# Altium project RPi_sensor_expansion_board.PrjPCB
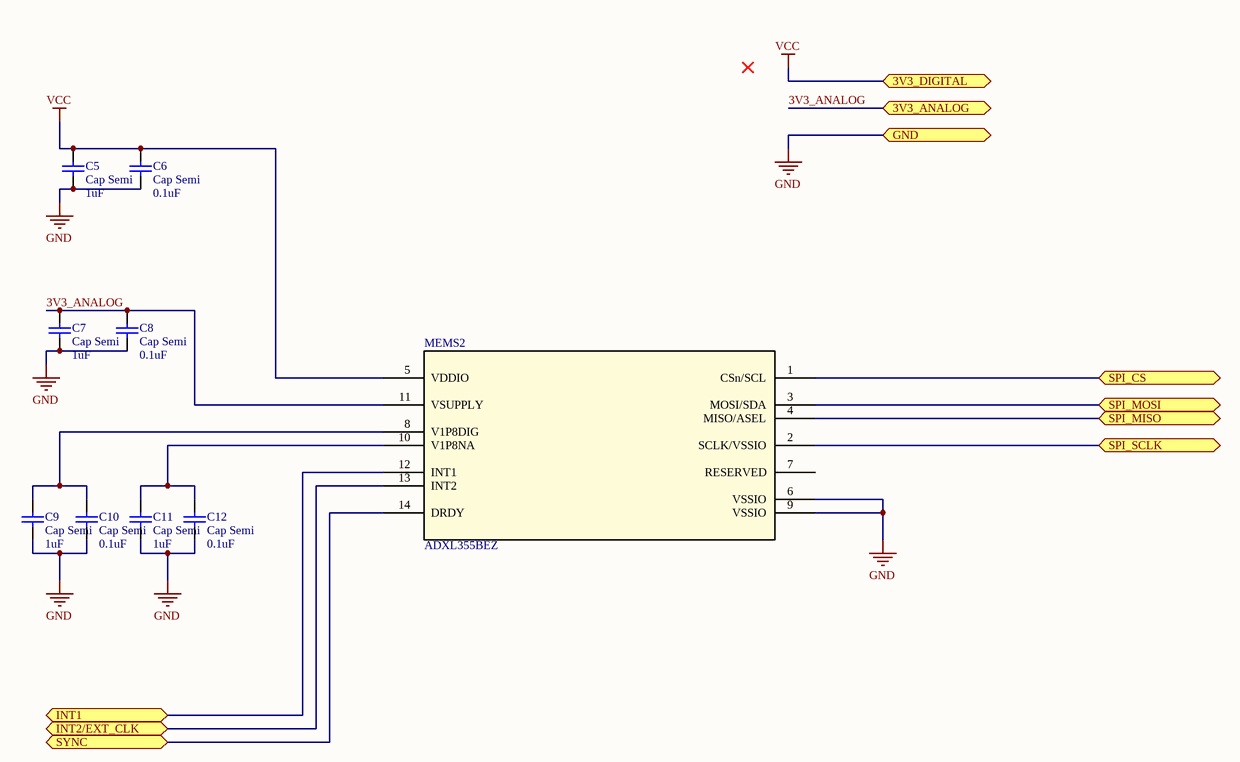
[diagram p0: accelerometer.SchDoc]
6 sheets, 58 parts. Net scope: flat (ports and power ports of the same name join across sheets).
Board file: RPi_sensor_expansion_board.PcbDoc
Sheets:
  accelerometer.SchDoc
  STM32.SchDoc
  RPi_header.SchDoc
  power.SchDoc
  gyroscope.SchDoc
  magnetometer.SchDoc

## Sheet accelerometer.SchDoc
size A4

### Parts
C5  Cap Semi  value 1uF  [C1210]
C6  Cap Semi  value 0.1uF  [C1206]
C7  Cap Semi  value 1uF  [C1210]
C8  Cap Semi  value 0.1uF  [C1206]
C9  Cap Semi  value 1uF  [C1210]
C10  Cap Semi  value 0.1uF  [C1206]
C11  Cap Semi  value 1uF  [C1210]
C12  Cap Semi  value 0.1uF  [C1206]
MEMS2  ADXL355BEZ  [E_14_1]

### Ports
3V3_ANALOG, 3V3_DIGITAL, GND, INT1, INT2/EXT_CLK, SPI_CS, SPI_MISO, SPI_MOSI, SPI_SCLK, SYNC

### Nets
GND: C5.1 C6.1 C7.1 C8.1 C9.1 C10.1 C11.1 C12.1 MEMS2.6(VSSIO) MEMS2.9(VSSIO) ; port GND
VCC: C5.2 C6.2 MEMS2.5(VDDIO) ; port 3V3_DIGITAL  [project net 3V3_DIGITAL]
3V3_ANALOG: C7.2 C8.2 MEMS2.11(VSUPPLY) ; port 3V3_ANALOG
GYRO_CS: MEMS2.1(CSn/SCL) ; port SPI_CS
GYRO_MISO: MEMS2.4(MISO/ASEL) ; port SPI_MISO
GYRO_MOSI: MEMS2.3(MOSI/SDA) ; port SPI_MOSI
GYRO_SCLK: MEMS2.2(SCLK/VSSIO) ; port SPI_SCLK
NetC9_2: C9.2 C10.2 MEMS2.8(V1P8DIG)
NetC11_2: C11.2 C12.2 MEMS2.10(V1P8NA)
NetMEMS2_12: MEMS2.12(INT1) ; port INT1
NetMEMS2_13: MEMS2.13(INT2) ; port INT2/EXT_CLK
NetMEMS2_14: MEMS2.14(DRDY) ; port SYNC

Not connected (* = marked no-connect by the designer): MEMS2 7(RESERVED)

### Library data of the parts
C5-C12 = Cap Semi: Capacitor (Semiconductor SIM Model); Published: 8-Jun-2000; LatestRevisionDate: 29-May-2009; LatestRevisionNote: IPC-7351 Footprint Added.; PackageReference: C1206; Publisher: Altium Limited; PackageDescription: Chip Capacitor
MEMS2 = ADXL355BEZ: Imported; Value: Value; Type: Type; RefDes: RefDes

## Sheet STM32.SchDoc
size A4
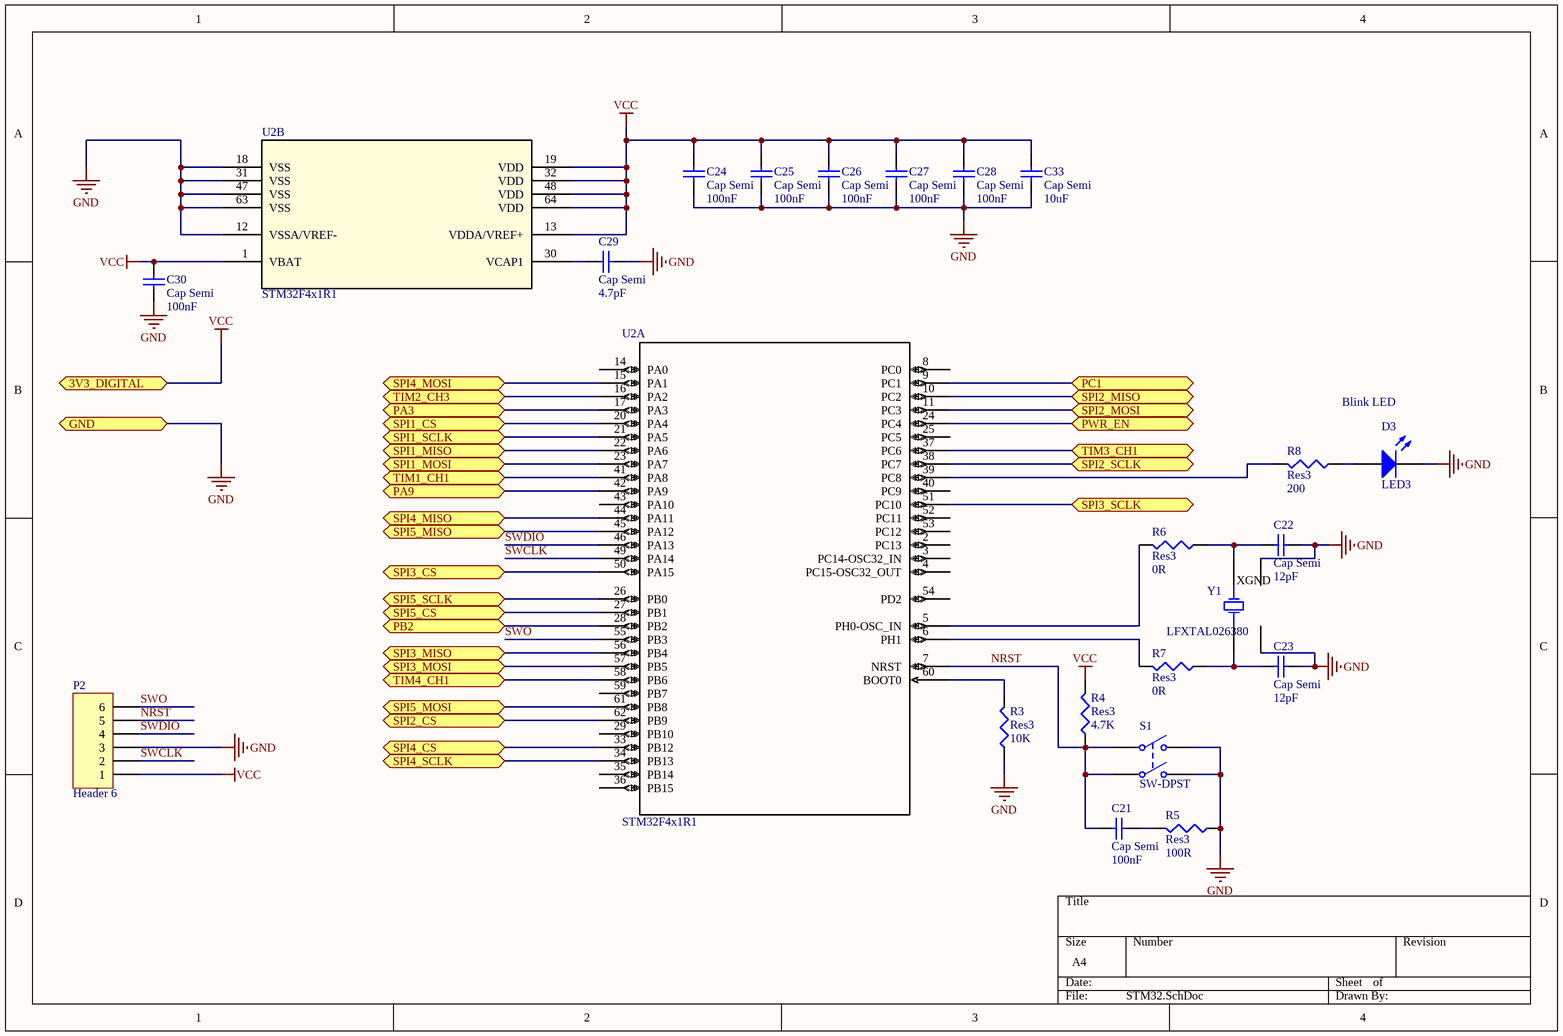
[diagram p1: STM32.SchDoc]

### Parts
C21  Cap Semi  value 100nF  [C1206]
C22  Cap Semi  value 12pF  [C1206]
C23  Cap Semi  value 12pF  [C1206]
C24  Cap Semi  value 100nF  [C1206]
C25  Cap Semi  value 100nF  [C1206]
C26  Cap Semi  value 100nF  [C1206]
C27  Cap Semi  value 100nF  [C1206]
C28  Cap Semi  value 100nF  [C1206]
C29  Cap Semi  value 4.7pF  [C1206]
C30  Cap Semi  value 100nF  [C1206]
C33  Cap Semi  value 10uF  [C1210]
D3  LED3  [3.5X2.8X1.9]
P2  Header 6  [HDR1X6]
R3  Res3  value 10K  [J1-0603]
R4  Res3  value 4.7K  [J1-0603]
R5  Res3  value 100R  [J1-0603]
R6  Res3  value 0R  [J1-0603]
R7  Res3  value 0R  [J1-0603]
R8  Res3  value 200  [J1-0603]
S1  SW-DPST  [TACT_SWITCH]
U2  STM32F4x1R1  [LQFP64-10x10mm]  (parts A,B of 2)
Y1  LFXTAL026380  [12SMX-B]

### Ports
3V3_DIGITAL, GND, PA3, PA9, PB2, PC1, PWR_EN, SPI1_CS, SPI1_MISO, SPI1_MOSI, SPI1_SCLK, SPI2_CS, SPI2_MISO, SPI2_MOSI, SPI2_SCLK, SPI3_CS, SPI3_MISO, SPI3_MOSI, SPI3_SCLK, SPI4_CS, SPI4_MISO, SPI4_MOSI, SPI4_SCLK, SPI5_CS, SPI5_MISO, SPI5_MOSI, SPI5_SCLK, TIM1_CH1, TIM2_CH3, TIM3_CH1, TIM4_CH1

### Nets
GND: C22.1 C23.1 C24.2 C25.2 C26.2 C27.2 C28.2 C29.1 C30.1 C33.2 D3.2(K) P2.3 R3.1 R5.1 S1.2(NO1) S1.4(NO2) U2.12(VSSA/VREF-) U2.18(VSS) U2.31(VSS) U2.47(VSS) U2.63(VSS) Y1.2(OSC2) Y1.4(OSC1) ; port GND
VCC: C24.1 C25.1 C26.1 C27.1 C28.1 C30.2 C33.1 P2.1 R4.2 U2.1(VBAT) U2.13(VDDA/VREF+) U2.19(VDD) U2.32(VDD) U2.48(VDD) U2.64(VDD) ; port 3V3_DIGITAL  [project net 3V3_DIGITAL]
NRST: C21.2 P2.5 R4.1 S1.1(COMMON1) S1.3(COMMON2) U2.7(NRST)
SWCLK: P2.2 U2.49(PA14)
SWDIO: P2.4 U2.46(PA13)
SWO: P2.6 U2.55(PB3)
NetC21_1: C21.1 R5.2
NetC22_2: C22.2 R6.1 Y1.3(OSC2)
NetC23_2: C23.2 R7.1 Y1.1(OSC1)
NetC29_2: C29.2 U2.30(VCAP1)
NetD3_1: D3.1(A) R8.1
NetP4_1: U2.24(PC4) ; port PWR_EN
NetR3_2: R3.2 U2.60(BOOT0)
NetR6_2: R6.2 U2.5(PH0-OSC_IN)
NetR7_2: R7.2 U2.6(PH1)
NetR8_2: R8.2 U2.39(PC8)
NetU2_9: U2.9(PC1) ; port PC1
NetU2_10: U2.10(PC2) ; port SPI2_MISO
NetU2_11: U2.11(PC3) ; port SPI2_MOSI
NetU2_15: U2.15(PA1) ; port SPI4_MOSI
NetU2_16: U2.16(PA2) ; port TIM2_CH3
NetU2_17: U2.17(PA3) ; port PA3
NetU2_20: U2.20(PA4) ; port SPI1_CS
NetU2_21: U2.21(PA5) ; port SPI1_SCLK
NetU2_22: U2.22(PA6) ; port SPI1_MISO
NetU2_23: U2.23(PA7) ; port SPI1_MOSI
NetU2_26: U2.26(PB0) ; port SPI5_SCLK
NetU2_27: U2.27(PB1) ; port SPI5_CS
NetU2_28: U2.28(PB2) ; port PB2
NetU2_33: U2.33(PB12) ; port SPI4_CS
NetU2_34: U2.34(PB13) ; port SPI4_SCLK
NetU2_37: U2.37(PC6) ; port TIM3_CH1
NetU2_38: U2.38(PC7) ; port SPI2_SCLK
NetU2_41: U2.41(PA8) ; port TIM1_CH1
NetU2_42: U2.42(PA9) ; port PA9
NetU2_44: U2.44(PA11) ; port SPI4_MISO
NetU2_45: U2.45(PA12) ; port SPI5_MISO
NetU2_50: U2.50(PA15) ; port SPI3_CS
NetU2_51: U2.51(PC10) ; port SPI3_SCLK
NetU2_56: U2.56(PB4) ; port SPI3_MISO
NetU2_57: U2.57(PB5) ; port SPI3_MOSI
NetU2_58: U2.58(PB6) ; port TIM4_CH1
NetU2_61: U2.61(PB8) ; port SPI5_MOSI
NetU2_62: U2.62(PB9) ; port SPI2_CS

Not connected (* = marked no-connect by the designer): U2 2(PC13) 3(PC14-OSC32_IN) 4(PC15-OSC32_OUT) 8(PC0) 14(PA0) 25(PC5) 29(PB10) 35(PB14) 36(PB15) 40(PC9) 43(PA10) 52(PC11) 53(PC12) 54(PD2) 59(PB7)

### Notes on the sheet
- Blink LED
- (in symbol LFXTAL026380) XGND

### Library data of the parts
C21-C30 C33 = Cap Semi: Capacitor (Semiconductor SIM Model); Published: 8-Jun-2000; LatestRevisionDate: 29-May-2009; LatestRevisionNote: IPC-7351 Footprint Added.; PackageReference: C1206; Publisher: Altium Limited; PackageDescription: Chip Capacitor
D3 = LED3: Typical BLUE SiC LED; Published: 8-Jun-2000; LatestRevisionDate: 17-Dec-2003; LatestRevisionNote: PCB Footprint replaced.; DatasheetVersion: 16-Apr-2002; PackageVersion: 16-Apr-2002; PackageReference: 3.5X2.8X1.9; Publisher: Altium Limited; PackageDescription: SM LED; 2 C-Bend Leads; Body 3.5 x 2.8 x 1.9 mm, inc leads (LxWxH typ)
P2 = Header 6: Header, 6-Pin; LatestRevisionDate: 17-Jul-2002; LatestRevisionNote: Re-released for DXP Platform.; Publisher: Altium Limited
R3-R8 = Res3: Resistor; Published: 8-Jun-2000; LatestRevisionDate: 29-May-2009; LatestRevisionNote: IPC-7351 Footprint Added.; PackageReference: J1-0603; Publisher: Altium Limited; PackageDescription: Chip Resistor
S1 = SW-DPST: Double-Pole, Single-Throw Switch; Published: 24-Mar-1999; LatestRevisionDate: 17-Jul-2002; LatestRevisionNote: Re-released for DXP Platform.; PackageReference: DPST-4; Publisher: Altium Limited; PackageDescription: Switch; 4 Leads
U2 = STM32F4x1R1: Imported; Vendor: STMicroelectronics; C: Copyright (C) 2016 Accelerated Designs. All rights reserved; Manufacturer_Part_Number: stm32f4x1r1; Copyright: Copyright (C) 2016 Accelerated Designs. All rights reserved; RefDes: RefDes; Type: Type; Value: Value

## Sheet RPi_header.SchDoc
size A4
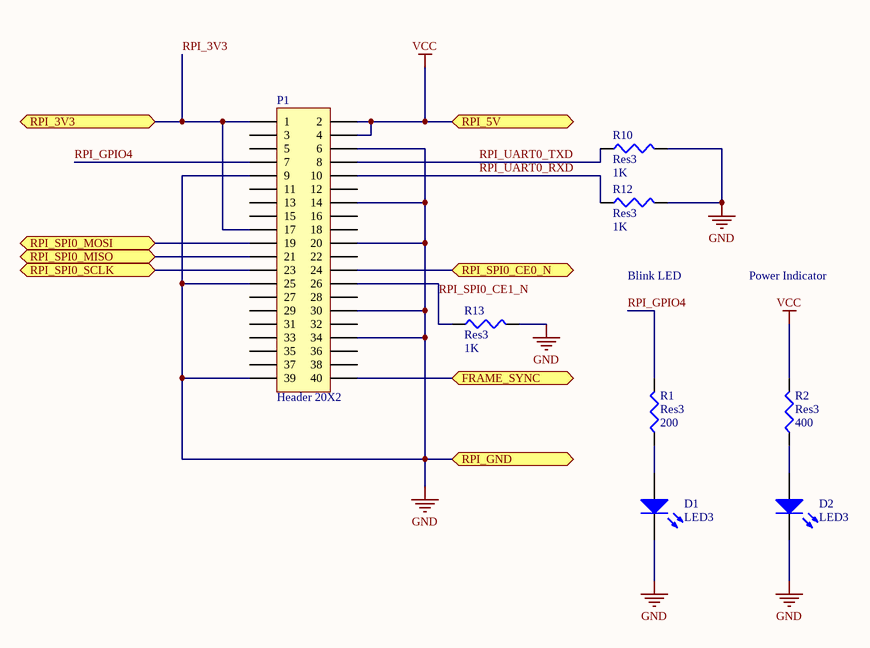
[diagram p2: RPi_header.SchDoc]

### Parts
D1  LED3  [3.5X2.8X1.9]
D2  LED3  [3.5X2.8X1.9]
P1  Header 20X2  [HDR2X20]
R1  Res3  value 200  [J1-0603]
R2  Res3  value 400  [J1-0603]
R10  Res3  value 1K  [J1-0603]
R12  Res3  value 1K  [J1-0603]
R13  Res3  value 1K  [J1-0603]

### Ports
FRAME_SYNC, RPI_3V3, RPI_5V, RPI_GND, RPI_SPI0_CE0_N, RPI_SPI0_MISO, RPI_SPI0_MOSI, RPI_SPI0_SCLK

### Nets
GND: D1.2(K) D2.2(K) P1.6 P1.9 P1.14 P1.20 P1.25 P1.30 P1.34 P1.39 R10.2 R12.2 R13.2 ; port RPI_GND
VCC: P1.2 P1.4 R2.2 ; port RPI_5V  [project net 3V3_DIGITAL]
RPI_3V3: P1.1 P1.17 ; port RPI_3V3
RPI_GPIO4: P1.7 R1.2
RPI_SPI0_CE1_N: P1.26 R13.1
RPI_UART0_RXD: P1.10 R12.1
RPI_UART0_TXD: P1.8 R10.1
NetD1_1: D1.1(A) R1.1
NetD2_1: D2.1(A) R2.1
NetP1_19: P1.19 ; port RPI_SPI0_MOSI
NetP1_21: P1.21 ; port RPI_SPI0_MISO
NetP1_23: P1.23 ; port RPI_SPI0_SCLK
NetP1_24: P1.24 ; port RPI_SPI0_CE0_N
NetP1_40: P1.40 ; port FRAME_SYNC

Not connected (* = marked no-connect by the designer): P1 3 5 11 12 13 15 16 18 22 27 28 29 31 32 33 35 36 37 38

### Notes on the sheet
- Blink LED
- Power Indicator

### Library data of the parts
D1 D2 = LED3: Typical BLUE SiC LED; Published: 8-Jun-2000; LatestRevisionDate: 17-Dec-2003; LatestRevisionNote: PCB Footprint replaced.; DatasheetVersion: 16-Apr-2002; PackageVersion: 16-Apr-2002; PackageReference: 3.5X2.8X1.9; Publisher: Altium Limited; PackageDescription: SM LED; 2 C-Bend Leads; Body 3.5 x 2.8 x 1.9 mm, inc leads (LxWxH typ)
P1 = Header 20X2: Header, 20-Pin, Dual row; LatestRevisionDate: 17-Jul-2002; LatestRevisionNote: Re-released for DXP Platform.; Publisher: Altium Limited
R1 R2 R10 R12 R13 = Res3: Resistor; Published: 8-Jun-2000; LatestRevisionDate: 29-May-2009; LatestRevisionNote: IPC-7351 Footprint Added.; PackageReference: J1-0603; Publisher: Altium Limited; PackageDescription: Chip Resistor

## Sheet power.SchDoc
size A4
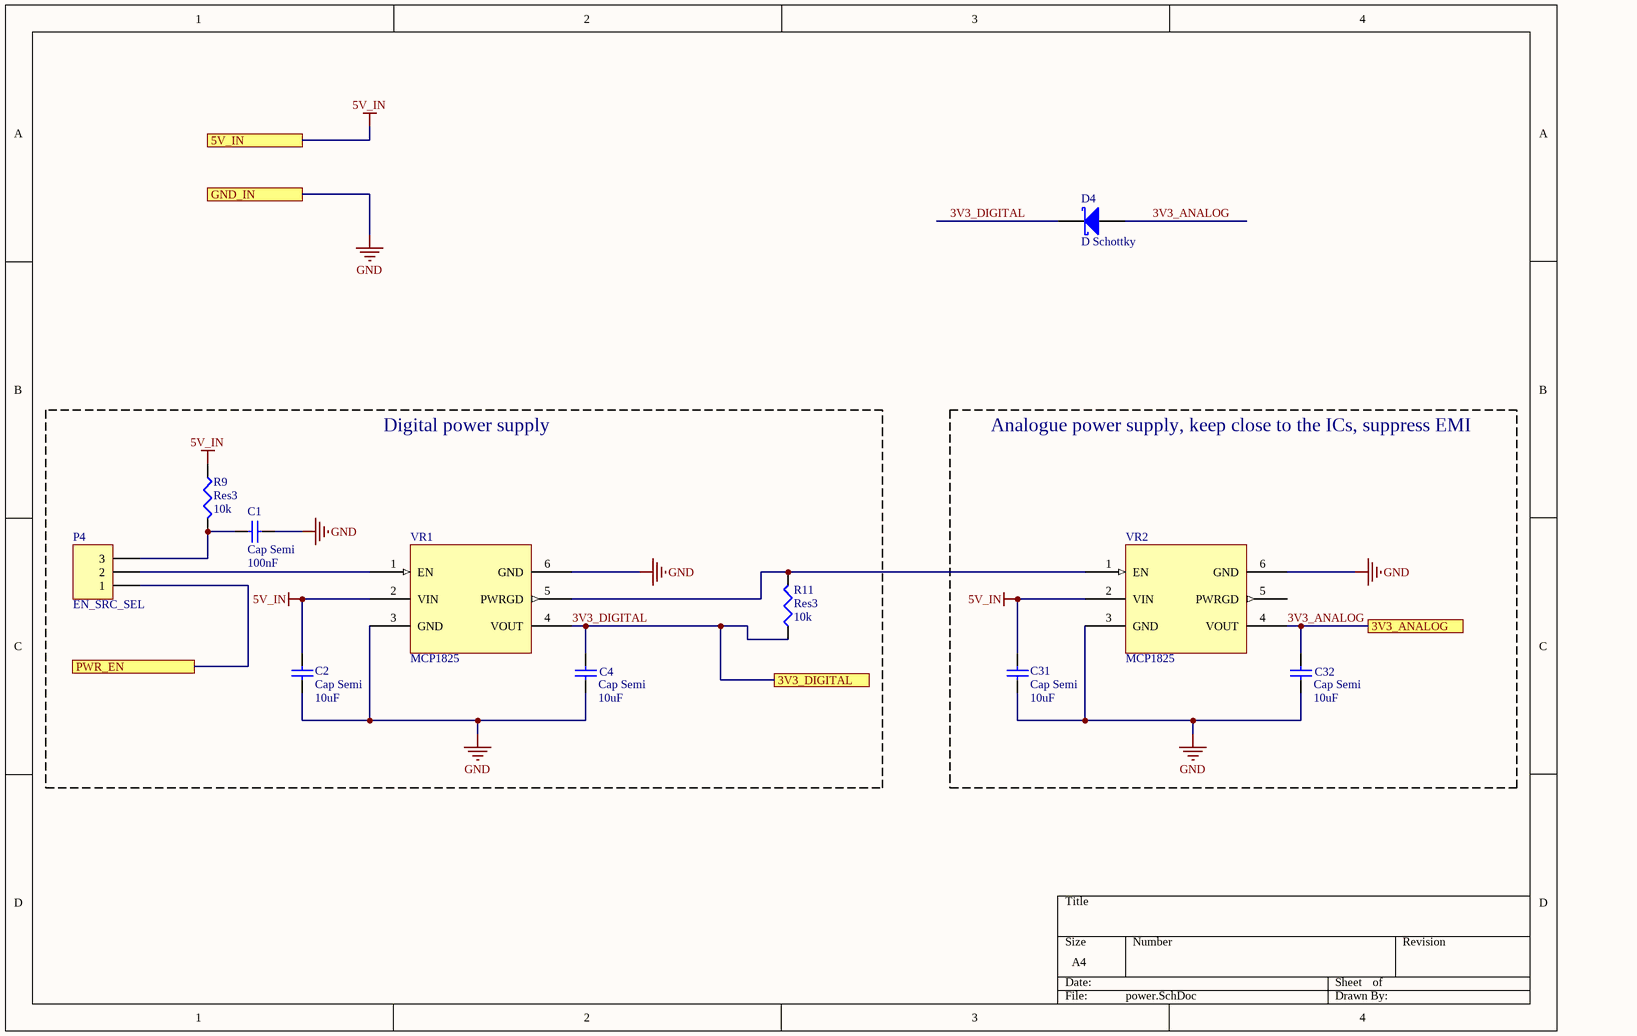
[diagram p3: power.SchDoc]

### Parts
C1  Cap Semi  value 100nF  [C1206]
C2  Cap Semi  value 10uF  [C1210]
C4  Cap Semi  value 10uF  [C1210]
C31  Cap Semi  value 10uF  [C1210]
C32  Cap Semi  value 10uF  [C1210]
D4  D Schottky  [SMB]
P4  EN_SRC_SEL  [HDR1X3]
R9  Res3  value 10k  [J1-0603]
R11  Res3  value 10k  [J1-0603]
VR1  MCP1825  [SOT-223-6]
VR2  MCP1825  [SOT-223-6]

### Blocks framed on the sheet
Digital power supply: C1 C2 C4 P4 R9 R11 VR1
Analogue power supply, keep close to the ICs, suppress EMI: C31 C32 VR2

### Ports
3V3_ANALOG, 3V3_DIGITAL, 5V_IN, GND_IN, PWR_EN

### Nets
3V3_DIGITAL: C4.2 D4.2(K) R11.1 VR1.4(VOUT) ; port 3V3_DIGITAL
5V_IN: C2.2 C31.2 R9.1 VR1.2(VIN) VR2.2(VIN) ; port 5V_IN
GND: C1.1 C2.1 C4.1 C31.1 C32.1 VR1.3(GND) VR1.6(GND) VR2.3(GND) VR2.6(GND) ; port GND_IN
3V3_ANALOG: C32.2 D4.1(A) VR2.4(VOUT) ; port 3V3_ANALOG
NetC1_2: C1.2 P4.3 R9.2
NetP4_1: P4.1 ; port PWR_EN
NetP4_2: P4.2 VR1.1(EN)
NetR11_2: R11.2 VR1.5(PWRGD) VR2.1(EN)

Not connected (* = marked no-connect by the designer): VR2 5(PWRGD)

### Library data of the parts
C1 C2 C4 C31 C32 = Cap Semi: Capacitor (Semiconductor SIM Model); Published: 8-Jun-2000; LatestRevisionDate: 29-May-2009; LatestRevisionNote: IPC-7351 Footprint Added.; PackageReference: C1206; Publisher: Altium Limited; PackageDescription: Chip Capacitor
D4 = D Schottky: Schottky Diode; Published: 8-Jun-2000; LatestRevisionDate: 17-Jul-2002; LatestRevisionNote: Re-released for DXP Platform.; PackageReference: SMB; Publisher: Altium Limited; PackageDescription: DO-214-AA/SMB; 2 C-Bend Leads; Body 5.3 x 3.6 mm, inc. leads (LxW); Code_JEDEC: DO-214-AA
P4 = Header 3: Header, 3-Pin; LatestRevisionDate: 17-Jul-2002; LatestRevisionNote: Re-released for DXP Platform.; Publisher: Altium Limited
R9 R11 = Res3: Resistor; Published: 8-Jun-2000; LatestRevisionDate: 29-May-2009; LatestRevisionNote: IPC-7351 Footprint Added.; PackageReference: J1-0603; Publisher: Altium Limited; PackageDescription: Chip Resistor
VR1 VR2 = MCP1825: 3.3V Voltage regulator

## Sheet gyroscope.SchDoc
size A4
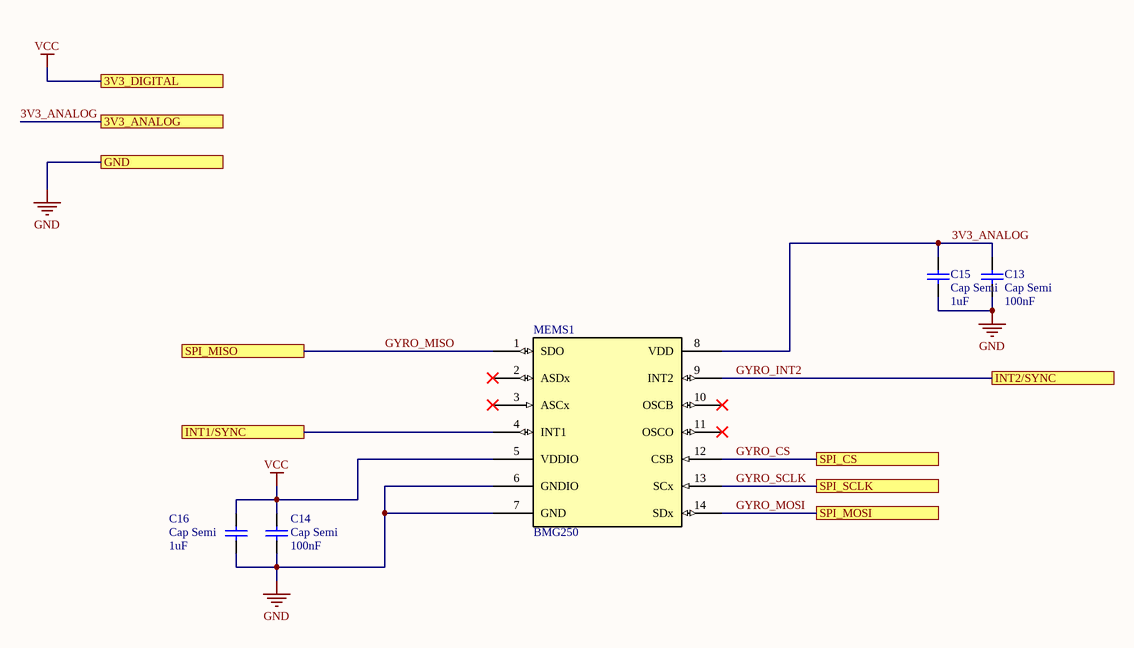
[diagram p4: gyroscope.SchDoc]

### Parts
C13  Cap Semi  value 100nF  [C1206]
C14  Cap Semi  value 100nF  [C1206]
C15  Cap Semi  value 1uF  [C1210]
C16  Cap Semi  value 1uF  [C1210]
MEMS1  BMG250  [LGA14-BOSCH]

### Ports
3V3_ANALOG, 3V3_DIGITAL, GND, INT1/SYNC, INT2/SYNC, SPI_CS, SPI_MISO, SPI_MOSI, SPI_SCLK

### Nets
GND: C13.1 C14.1 C15.1 C16.1 MEMS1.6(GNDIO) MEMS1.7(GND) ; port GND
VCC: C14.2 C16.2 MEMS1.5(VDDIO) ; port 3V3_DIGITAL  [project net 3V3_DIGITAL]
3V3_ANALOG: C13.2 C15.2 MEMS1.8(VDD) ; port 3V3_ANALOG
GYRO_CS: MEMS1.12(CSB) ; port SPI_CS
GYRO_INT2: MEMS1.9(INT2) ; port INT2/SYNC
GYRO_MISO: MEMS1.1(SDO) ; port SPI_MISO
GYRO_MOSI: MEMS1.14(SDx) ; port SPI_MOSI
GYRO_SCLK: MEMS1.13(SCx) ; port SPI_SCLK
NetMEMS1_4: MEMS1.4(INT1) ; port INT1/SYNC

Not connected (* = marked no-connect by the designer): MEMS1 2(ASDx)* 3(ASCx)* 10(OSCB)* 11(OSCO)*

### Library data of the parts
C13-C16 = Cap Semi: Capacitor (Semiconductor SIM Model); Published: 8-Jun-2000; LatestRevisionDate: 29-May-2009; LatestRevisionNote: IPC-7351 Footprint Added.; PackageReference: C1206; Publisher: Altium Limited; PackageDescription: Chip Capacitor

## Sheet magnetometer.SchDoc
size A4
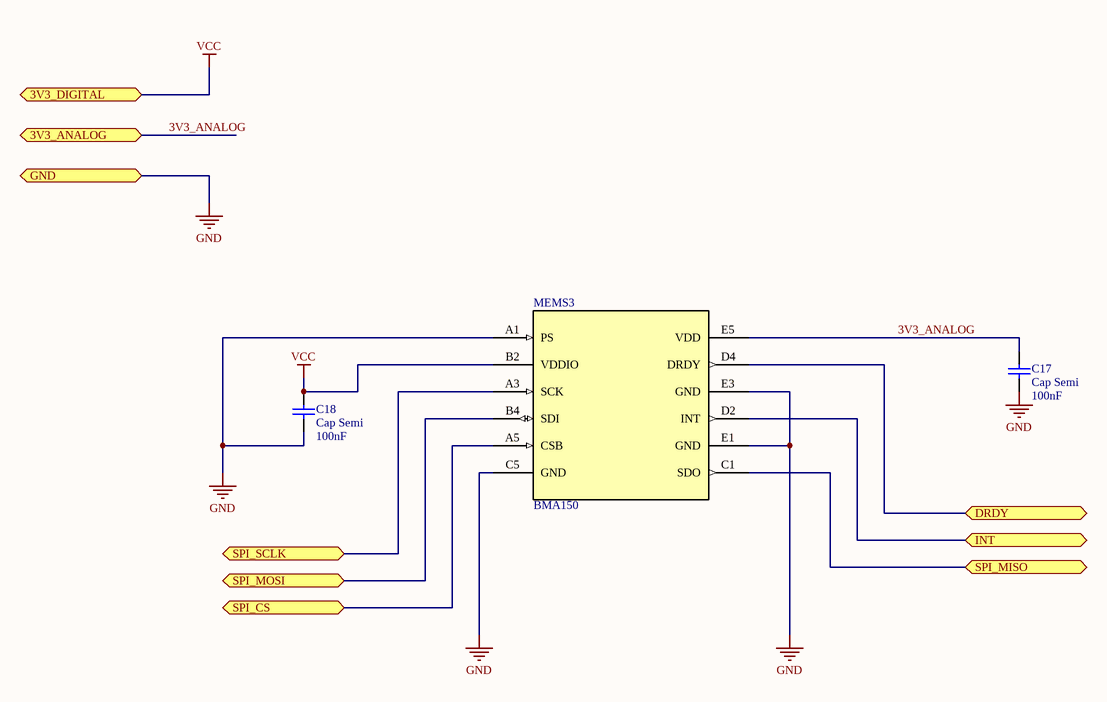
[diagram p5: magnetometer.SchDoc]

### Parts
C17  Cap Semi  value 100nF  [C1206]
C18  Cap Semi  value 100nF  [C1206]
MEMS3  BMA150  [BGA12-BOSCH]

### Ports
3V3_ANALOG, 3V3_DIGITAL, DRDY, GND, INT, SPI_CS, SPI_MISO, SPI_MOSI, SPI_SCLK

### Nets
GND: C17.1 C18.1 MEMS3.A1(PS) MEMS3.C5(GND) MEMS3.E1(GND) MEMS3.E3(GND) ; port GND
VCC: C18.2 MEMS3.B2(VDDIO) ; port 3V3_DIGITAL  [project net 3V3_DIGITAL]
3V3_ANALOG: C17.2 MEMS3.E5(VDD) ; port 3V3_ANALOG
GYRO_CS: MEMS3.A5(CSB) ; port SPI_CS
GYRO_MISO: MEMS3.C1(SDO) ; port SPI_MISO
GYRO_MOSI: MEMS3.B4(SDI) ; port SPI_MOSI
GYRO_SCLK: MEMS3.A3(SCK) ; port SPI_SCLK
NetMEMS3_D2: MEMS3.D2(INT) ; port INT
NetMEMS3_D4: MEMS3.D4(DRDY) ; port DRDY

### Library data of the parts
C17 C18 = Cap Semi: Capacitor (Semiconductor SIM Model); Published: 8-Jun-2000; LatestRevisionDate: 29-May-2009; LatestRevisionNote: IPC-7351 Footprint Added.; PackageReference: C1206; Publisher: Altium Limited; PackageDescription: Chip Capacitor

## Nets that join several sheets
3V3_DIGITAL: accelerometer (C5.2 C6.2 MEMS2.5), STM32 (15 pins), RPi_header (P1.2 P1.4 R2.2), power (C4.2 D4.2 R11.1 VR1.4), gyroscope (C14.2 C16.2 MEMS1.5), magnetometer (C18.2 MEMS3.B2)
GND: accelerometer (10 pins), STM32 (23 pins), RPi_header (13 pins), power (9 pins), gyroscope (6 pins), magnetometer (6 pins)
3V3_ANALOG: accelerometer (C7.2 C8.2 MEMS2.11), power (C32.2 D4.1 VR2.4), gyroscope (C13.2 C15.2 MEMS1.8), magnetometer (C17.2 MEMS3.E5)
GYRO_CS: accelerometer (MEMS2.1), gyroscope (MEMS1.12), magnetometer (MEMS3.A5)
GYRO_MISO: accelerometer (MEMS2.4), gyroscope (MEMS1.1), magnetometer (MEMS3.C1)
GYRO_MOSI: accelerometer (MEMS2.3), gyroscope (MEMS1.14), magnetometer (MEMS3.B4)
GYRO_SCLK: accelerometer (MEMS2.2), gyroscope (MEMS1.13), magnetometer (MEMS3.A3)
NetP4_1: STM32 (U2.24), power (P4.1)